# EAGLE design SenseRing (EAGLE 9.7.0)
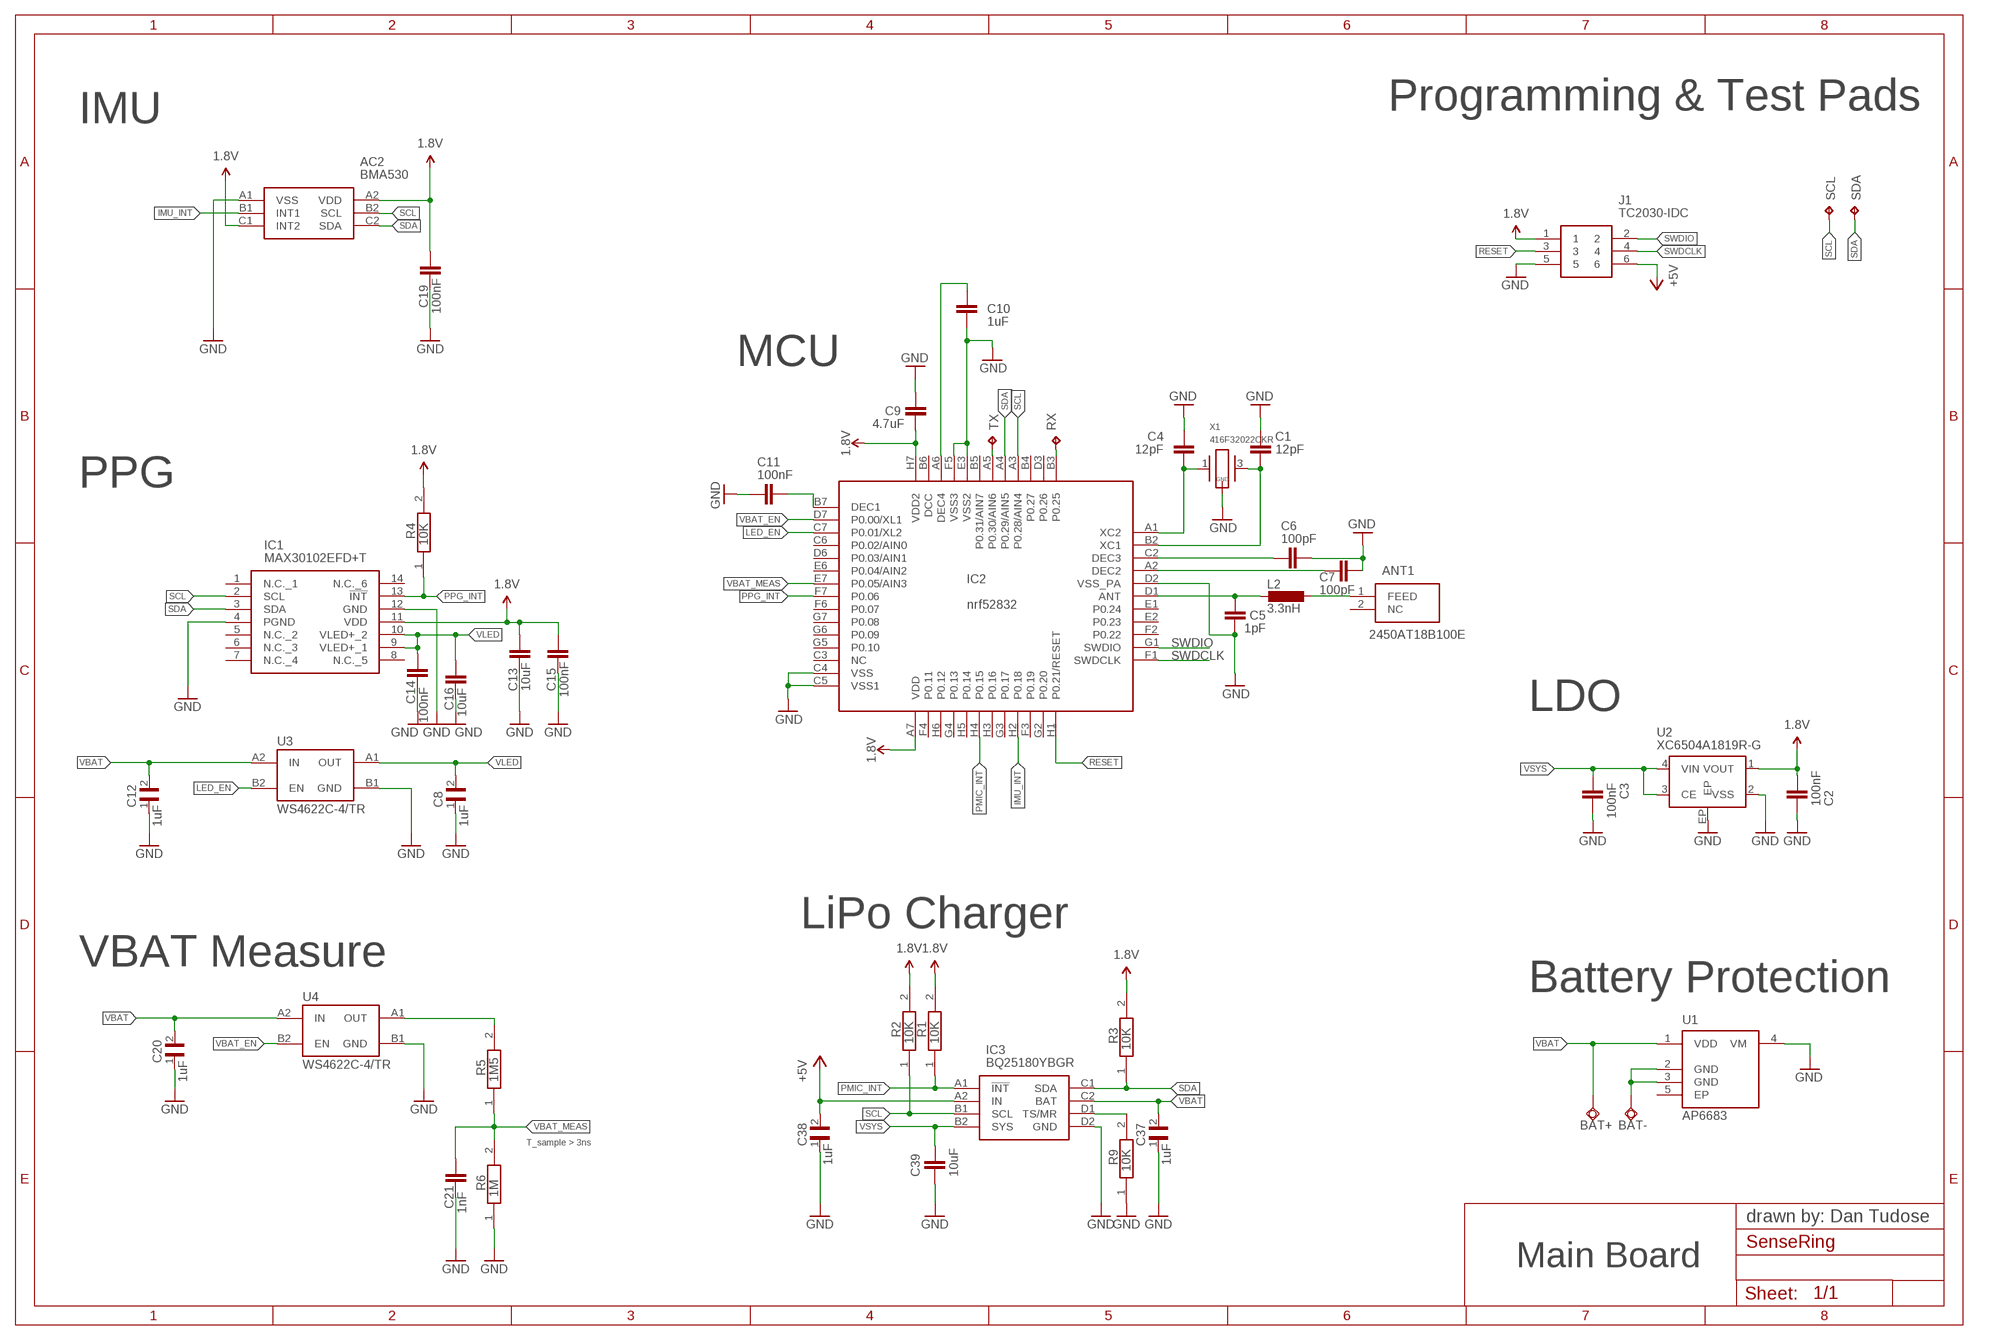
[diagram p0: schematic, sheet 1]

## Parts
AC2  BMA530  [BMA530]
ANT1  2450AT18B100E  [ANTC3216X140N]
BAT+  TPSQTP10SQ  [TP10SQ]
BAT-  TPSQTP10SQ  [TP10SQ]
C1  12pF  C-EUC0201  [C0201]
C2  100nF  C-EUC0201  [C0201]
C3  100nF  C-EUC0201  [C0201]
C4  12pF  C-EUC0201  [C0201]
C5  1pF  C-EUC0201  [C0201]
C6  100pF  C-EUC0201  [C0201]
C7  100pF  C-EUC0201  [C0201]
C8  1uF  GRM011R60J152KE01L  [0201]
C9  4.7uF  C-EUC0201  [C0201]
C10  1uF  C-EUC0201  [C0201]
C11  100nF  C-EUC0201  [C0201]
C12  1uF  GRM011R60J152KE01L  [0201]
C13  10uF  CAP_0402  [0402]
C14  100nF  C-EUC0201  [C0201]
C15  100nF  C-EUC0201  [C0201]
C16  10uF  CAP_0402  [0402]
C19  100nF  C-EUC0201  [C0201]
C20  1uF  GRM011R60J152KE01L  [0201]
C21  1nF  C-EUC0201  [C0201]
C37  1uF  GRM011R60J152KE01L  [0201]
C38  1uF  GRM011R60J152KE01L  [0201]
C39  10uF  CAP_0402  [0402]
IC1  MAX30102EFD+T  [MAX30102EFDT]
IC2  nrf52832  NRF52832  [NRF52832_WLCSP]
IC3  BQ25180YBGR  [BGA8C40P2X4_100X155X50]
J1  TC2030-IDC  [TC2030IDC]
L2  3.3nH  L-EUL0201  [L0201]
R1  10K  CPF0201D7K68C1  [0201]
R2  10K  CPF0201D7K68C1  [0201]
R3  10K  CPF0201D7K68C1  [0201]
R4  10K  CPF0201D7K68C1  [0201]
R5  1M5  CPF0201D7K68C1  [0201]
R6  1M  CPF0201D7K68C1  [0201]
R9  10K  CPF0201D7K68C1  [0201]
RX  TPTP06R  [TP06R]
SCL  TPTP06R  [TP06R]
SDA  TPTP06R  [TP06R]
TX  TPTP06R  [TP06R]
U1  AP6683  [DFN-4_L1.0-W1.0-P0.65-BL-EP]
U2  XC6504A1819R-G  [USPQ-4B04]
U3  WS4622C-4/TR  [CSP-4L_1X1]
U4  WS4622C-4/TR  [CSP-4L_1X1]
X1  416F32022CKR  M416F26022CKR  [M416]

## Nets
1.8V: AC2.A2(VDD) AC2.C1(INT2) C2.1 C9.2 C13.1 C15.2 C19.2 IC1.11(VDD) IC2.A7(VDD) IC2.H7(VDD2) J1.1 R1.2 R2.2 R3.2 R4.2 U2.1(VOUT)
+5V: C38.2 IC3.A2(IN) J1.6
GND: AC2.A1(VSS) C1.1 C2.2 C3.1 C4.1 C5.2 C6.2 C7.2 C8.1 C9.1 C10.2 C11.2 C12.1 C13.2 C14.1 C15.1 C16.2 C19.1 C20.1 C21.1 C37.1 C38.1 C39.2 IC1.4(PGND) IC1.12(GND) IC2.C4(VSS) IC2.C5(VSS1) IC2.D2(VSS_PA) IC2.E3(VSS2) IC2.F5(VSS3) IC3.D2(GND) J1.5 R6.1 R9.1 U1.4(VM) U2.2(VSS) U2.EP U3.B1(GND) U4.B1(GND) X1.2(GND) X1.4(GND)
IMU_INT: AC2.B1(INT1) IC2.H2(P0.18)
LED_EN: IC2.C7(P0.01/XL2) U3.B2(EN)
N$1: BAT-.TP U1.2(GND) U1.3(GND)
N$2: IC2.A5(P0.30/AIN6) TX.TP
N$3: IC2.B3(P0.25) RX.TP
N$4: C4.2 IC2.A1(XC2) X1.1
N$5: C7.1 IC2.A2(DEC2)
N$6: C1.2 IC2.B2(XC1) X1.3
N$7: C5.1 IC2.D1(ANT) L2.2
N$9: C6.1 IC2.C2(DEC3)
N$12: IC3.D1(TS/MR) R9.2
N$13: ANT1.1(FEED) L2.1
N$19: C11.1 IC2.B7(DEC1)
N$20: C10.1 IC2.A6(DEC4)
PMIC_INT: IC2.H4(P0.15) IC3.A1(!INT) R1.1
PPG_INT: IC1.13(!INT) IC2.F7(P0.06) R4.1
RESET: IC2.H1(P0.21/RESET) J1.3
SCL: AC2.B2(SCL) IC1.2(SCL) IC2.A3(P0.28/AIN4) IC3.B1(SCL) R2.1 SCL.TP
SDA: AC2.C2(SDA) IC1.3(SDA) IC2.A4(P0.29/AIN5) IC3.C1(SDA) R3.1 SDA.TP
SWDCLK: IC2.F1(SWDCLK) J1.4
SWDIO: IC2.G1(SWDIO) J1.2
VBAT: BAT+.TP C12.2 C20.2 C37.2 IC3.C2(BAT) U1.1(VDD) U3.A2(IN) U4.A2(IN)
VBAT_EN: IC2.D7(P0.00/XL1) U4.B2(EN)
VBAT_MEAS: C21.2 IC2.E7(P0.05/AIN3) R5.1 R6.2
VBAT_OUT: R5.2 U4.A1(OUT)
VLED: C8.2 C14.2 C16.1 IC1.9(VLED+_1) IC1.10(VLED+_2) U3.A1(OUT)
VSYS: C3.2 C39.1 IC3.B2(SYS) U2.3(CE) U2.4(VIN)
Unconnected: ANT1.2(NC) IC1.1(N.C._1) IC1.5(N.C._2) IC1.6(N.C._3) IC1.7(N.C._4) IC1.8(N.C._5) IC1.14(N.C._6) IC2.B4(P0.27) IC2.B5(P0.31/AIN7) IC2.B6(DCC) IC2.C3(NC) IC2.C6(P0.02/AIN0) IC2.D3(P0.26) IC2.D6(P0.03/AIN1) IC2.E1(P0.24) IC2.E2(P0.23) IC2.E6(P0.04/AIN2) IC2.F2(P0.22) IC2.F3(P0.19) IC2.F4(P0.11) IC2.F6(P0.07) IC2.G2(P0.20) IC2.G3(P0.17) IC2.G4(P0.13) IC2.G5(P0.10) IC2.G6(P0.09) IC2.G7(P0.08) IC2.H3(P0.16) IC2.H5(P0.14) IC2.H6(P0.12) U1.5(EP)

## Notes on the sheet
- IMU | Programming & Test Pads
- MCU
- PPG
- LDO
- LiPo Charger
- VBAT Measure
- Battery Protection
- T_sample > 3ns
- drawn by: Dan Tudose
- Main Board

## Library data of the parts
AC2 = BMA530:BMA530: Accelerometer with advanced feature set Source: Datasheet <https://www.bosch-sensortec.com/media/boschsensortec/downloads/datasheets/bst-bma530-ds000.pdf>; ARROW_PART_NUMBER: BMA530; ARROW_PRICE-STOCK: https://www.arrow.com/en/products/bma530/bosch-sensortec.html?utm_currency=USD&region=nac; DESCRIPTION: Accelerometer with advanced feature set; HEIGHT: 0.59mm; MANUFACTURER_NAME: BOSCH; MANUFACTURER_PART_NUMBER: BMA530; MOUSER_PART_NUMBER: 262-BMA530; MOUSER_PRICE-STOCK: https://www.mouser.co.uk/ProductDetail/Bosch-Sensortec/BMA530?qs=2wMNvWM5ZX4xN1KGqjzO%252Bg%3D%3D
ANT1 = 2450AT18B100E:2450AT18B100E: Antennas 2.45GHz ANTENNA Source: Datasheet <https://www.johansontechnology.com/datasheets/2450AT18B100/2450AT18B100.pdf>; ARROW_PART_NUMBER: 2450AT18B100E; ARROW_PRICE-STOCK: https://www.arrow.com/en/products/2450at18b100e/johanson-dielectrics?utm_currency=USD&region=europe; DESCRIPTION: Antennas 2.45GHz ANTENNA; HEIGHT: 1.4mm; MANUFACTURER_NAME: JOHANSON TECHNOLOGY; MANUFACTURER_PART_NUMBER: 2450AT18B100E; MOUSER_PART_NUMBER: 609-2450AT18B100E; MOUSER_PRICE-STOCK: https://www.mouser.co.uk/ProductDetail/Johanson-Technology/2450AT18B100E?qs=yCnrNFeXz%252Bh5MFsFIXGZGA%3D%3D
BAT+ BAT- = testpad:TPSQ: Test pad
C1-C7 C9-C11 C14 C15 C19 C21 = rcl:C-EU: CAPACITOR, European symbol; SPICEPREFIX: C
C8 C12 C20 C37 C38 = GRM011R60J152KE01L:GRM011R60J152KE01L: Check availability <https://pricing.snapeda.com/parts/GRM011R60J152KE01L/Murata/view-part?ref=eda>; SPICEPREFIX: C
C13 C16 C39 = Perfect_0402:CAP_0402: 0402 (1005 Metric) Nick Garner - TeleSense
IC1 = MAX30102EFD+T:MAX30102EFD+T: Biometric Sensors Integrated Optical Sensor Source: Datasheet <https://www.analog.com/media/en/technical-documentation/data-sheets/MAX30102.pdf>; ARROW_PART_NUMBER: MAX30102EFD+T; ARROW_PRICE-STOCK: https://www.arrow.com/en/products/max30102efdt/analog-devices?region=nac; DESCRIPTION: Biometric Sensors Integrated Optical Sensor; HEIGHT: 1.65mm; MANUFACTURER_NAME: Analog Devices; MANUFACTURER_PART_NUMBER: MAX30102EFD+T; MOUSER_PART_NUMBER: 700-MAX30102EFD+T; MOUSER_PRICE-STOCK: https://www.mouser.co.uk/ProductDetail/Analog-Devices-Maxim-Integrated/MAX30102EFD%2bT?qs=nVS1qgv%252BQrkHA4%2FoFYriFA%3D%3D
IC2 = dan:NRF52832
IC3 = BQ25180YBGR:BQ25180YBGR: Charger IC Lithium Ion/Polymer, Lithium Iron Phosphate 8-DSBGA (1.6x1.1) Source: Datasheet <https://www.ti.com/lit/ds/symlink/bq25180.pdf?ts=1650264094470&ref_url=https%3A%2F%2Fwww.ti.com%2Fproduct%2FBQ25180>; ARROW_PART_NUMBER: BQ25180YBGR; ARROW_PRICE-STOCK: https://www.arrow.com/en/products/bq25180ybgr/texas-instruments?utm_currency=USD&region=nac; DESCRIPTION: Charger IC Lithium Ion/Polymer, Lithium Iron Phosphate 8-DSBGA (1.6x1.1); HEIGHT: 0.5mm; MANUFACTURER_NAME: Texas Instruments; MANUFACTURER_PART_NUMBER: BQ25180YBGR; MOUSER_PART_NUMBER: 595-BQ25180YBGR; MOUSER_PRICE-STOCK: https://www.mouser.co.uk/ProductDetail/Texas-Instruments/BQ25180YBGR?qs=doiCPypUmgEWjAK%252BJAX6Tw%3D%3D
J1 = TC2030-IDC:TC2030-IDC: CABLE ADAPTER 6 POS Source: Datasheet <https://datasheet.datasheetarchive.com/originals/distributors/Datasheets_SAMA/62bc384e093448baaaa63dbd0b9d8707.pdf>; DESCRIPTION: CABLE ADAPTER 6 POS; HEIGHT: 19mm; MANUFACTURER_NAME: Tag Connect; MANUFACTURER_PART_NUMBER: TC2030-IDC
L2 = rcl:L-EU: INDUCTOR, European symbol; SPICEPREFIX: L
R1-R6 R9 = ERA-1AEB3401C:CPF0201D7K68C1: 7.68k 0201 Thin Film Surface Mount Fixed Resistor +/-0.5% 0.031W CPF0201D7K68C1 Source: Datasheet <http://www.te.com/commerce/DocumentDelivery/DDEController?Action=showdoc&DocId=Data Sheet1773200-1ApdfEnglishENG_DS_1773200-1_A.pdf4-2176215-6>; SPICEPREFIX: R
RX SCL SDA TX = testpad:TP: Test pad
U1 = AP6683:AP6683: Single-cell lithium ion and lithium polymer battery protection IC Manufacturer: ALLPOWER Supplier Part: C2849565; DATASHEET: https://item.szlcsc.com/datasheet/AP6683/3049182.html; MANUFACTURER: ALLPOWER; MPN: AP6683; SUPPLIER: LCSC; SUPPLIER_PART: C2849565
U2 = XC6504A1819R-G:XC6504A1819R-G: IC REG LIN 1.8V 150MA USPQ-4B04 Manufacturer: Torex Semiconductor Ltd Package: USPQ-4B04 (1.0 mm x 1.0 mm) JLCPCB Part: C5142782 Note: The thermal pad (EP) should be connected to VSS as per datasheet recommendations.; JLCPCB: C5142782; MANUFACTURER: Torex Semiconductor Ltd; MPN: XC6504A1819R-G
U3 U4 = WS4622C:WS4622C-4/TR: WS4622C-4/TR 1.2V~5.5V, 2A, 38mΩ Active High Load Switch Manufacturer: WILLSEMI (Will Semiconductor) Package: CSP-4L (1.0 mm x 1.0 mm) JLCPCB Part: C2939859; JLCPCB: C2939859; MANUFACTURER: WILLSEMI; MPN: WS4622C-4/TR
X1 = crystals:M416; DIGIKEY: CTX1407CT-ND

## Net classes
1 power: width 0.15 mm

## Board
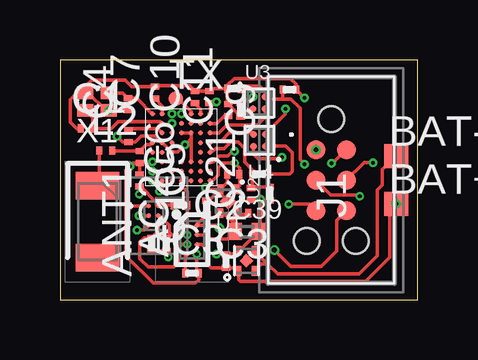
[diagram p1: board, top side]
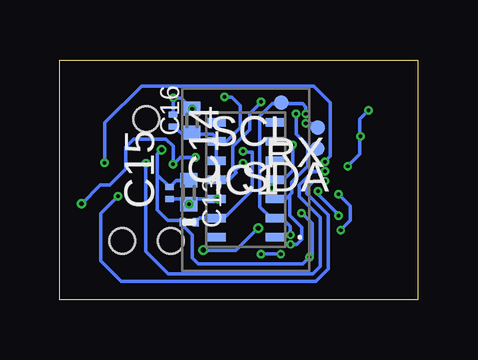
[diagram p2: board, bottom side, seen from below]

Size 14.9 x 10 mm. Coordinates in mm from the lower left corner, seen from the top.
Outline: 0,10 0,0 14.9,0 14.9,10 0,10
Copper layers (1*16): Top 0.035mm / dielectric 1.5mm / Bottom 0.035mm
Design rules "Fusion Electronics Design Rules *": minimum track width 6mil, minimum drill 0.2mm, track to track 6mil, track to pad 6mil, pad to pad 6mil, via to via 6mil, smd to smd 6mil, copper to edge 40mil, drill to drill 6mil, minimum pad ring 0.1mm, minimum via ring 0.1mm, stop-mask expansion 4mil, vias tented up to drill 9999mil, thermal gap 10mil

### Footprints (pad centres in the part's own frame; a part is rotated, then mirrored left to right if it is on the bottom)
BMA530 = smd 0.18 x 0.18: A1 -0.4,-0.2; A2 -0.4,0.2; B1 0,-0.2; B2 0,0.2; C1 0.4,-0.2; C2 0.4,0.2
ANTC3216X140N = smd 1.15 x 1.8: 1 -1.5,0; 2 1.5,0
TP10SQ = smd 1 x 1: TP 0,0
C0201 = smd 0.25 x 0.35: 1 -0.25,0; 2 0.25,0
0201 = smd 0.35 x 0.25: 1 0,0.275; 2 0,-0.275
0402 = smd 0.6 x 0.7: 1 -0.5,0; 2 0.5,0
MAX30102EFDT = smd 0.75 x 0.35: 1 -1.2,2.4; 2 -1.2,1.6; 3 -1.2,0.8; 4 -1.2,0; 5 -1.2,-0.8; 6 -1.2,-1.6; 7 -1.2,-2.4; 8 1.2,-2.4; 9 1.2,-1.6; 10 1.2,-0.8; 11 1.2,0; 12 1.2,0.8; 13 1.2,1.6; 14 1.2,2.4
NRF52832_WLCSP = smd 0.2 x 0.2: A1 -1.2,1.4; A2 -0.8,1.4; A3 -0.4,1.4; A4 0,1.4; A5 0.4,1.4; A6 0.8,1.4; A7 1.2,1.4; B2 -0.8,1; B3 -0.4,1; B4 0,1; B5 0.4,1; B6 0.8,1; B7 1.2,1; C2 -0.8,0.6; C3 -0.4,0.6; C4 0,0.6; C5 0.4,0.6; C6 0.8,0.6; C7 1.2,0.6; D1 -1.2,0.2; D2 -0.8,0.2; D3 -0.4,0.2; D6 0.8,0.2; D7 1.2,0.2; E1 -1.2,-0.2; E2 -0.8,-0.2; E3 -0.4,-0.2; E6 0.8,-0.2; E7 1.2,-0.2; F1 -1.2,-0.6; F2 -0.8,-0.6; F3 -0.4,-0.6; F4 0,-0.6; F5 0.4,-0.6; F6 0.8,-0.6; F7 1.2,-0.6; G1 -1.2,-1; G2 -0.8,-1; G3 -0.4,-1; G4 0,-1; G5 0.4,-1; G6 0.8,-1; G7 1.2,-1; H1 -1.2,-1.4; H2 -0.8,-1.4; H3 -0.4,-1.4; H4 0,-1.4; H5 0.4,-1.4; H6 0.8,-1.4; H7 1.2,-1.4
BGA8C40P2X4_100X155X50 = smd 0.2 x 0.2: A1 -0.2,0.6; A2 0.2,0.6; B1 -0.2,0.2; B2 0.2,0.2; C1 -0.2,-0.2; C2 0.2,-0.2; D1 -0.2,-0.6; D2 0.2,-0.6
TC2030IDC = smd 0.783 x 0.783: 1 -0.953,-0.635; 2 -0.953,0.635; 3 0.317,-0.635; 4 0.317,0.635; 5 1.588,-0.635; 6 1.588,0.635 | hole 1.067: -2.223,0; 2.857,-1.016; 2.857,1.016
L0201 = smd 0.25 x 0.35: 1 -0.275,0; 2 0.275,0
TP06R = smd 0.6 x 0.6: TP 0,0
DFN-4_L1.0-W1.0-P0.65-BL-EP = smd 0.2 x 0.4: 1 -0.325,-0.425; 2 0.325,-0.425; 3 0.325,0.425; 4 -0.325,0.425 | smd 0.4 x 0.4 rotated 225: 5 0,0
USPQ-4B04 = smd 0.4 x 0.25: 1 -0.501,0.325; 2 -0.501,-0.325; 3 0.501,-0.325; 4 0.475,0.325 | smd 0.48 x 0.48 rotated 135: EP 0,0
CSP-4L_1X1 = smd 0.3 x 0.3: A1 -0.25,0.25; A2 0.25,0.25; B1 -0.25,-0.25; B2 0.25,-0.25
M416 = smd 0.67 x 0.52: 1 -0.485,-0.36; 2 0.485,-0.36; 3 0.485,0.36; 4 -0.485,0.36

### Placement (x,y rotation side)
AC2  3.9,3.5 270 top
ANT1  1.57,3.25 270 top
BAT+  14,4 0 top
BAT-  14,6 0 top
C1  1.11,7.14 0 top
C2  7.21,5.23 180 top
C3  8.1,3.61 180 top
C4  2.84,8.15 90 top
C5  3.32,5.94 270 top
C6  2.86,6.83 270 top
C7  3.96,8.63 90 top
C8  7.52,7.92 180 top
C9  6.23,8.44 270 top
C10  5.63,8.44 90 top
C11  7.01,7.91 90 top
C12  7.25,8.8 90 top
C13  9.53,4.47 270 bottom
C14  10.18,7.47 270 bottom
C15  10.33,4.44 90 bottom
C16  9.4,7.47 90 bottom
C19  3.32,4.96 270 top
C20  9.56,8.76 270 top
C21  7.95,4.41 90 top
C37  6.92,1.61 0 top
C38  6.11,3.83 0 top
C39  7.78,2.84 0 top
IC1  7.16,5 180 bottom
IC2  5.06,6.35 0 top
IC3  5.5,2.5 0 top
J1  11.3,5.3 270 top
L2  1.91,6.22 0 top
R1  5.02,3.94 270 top
R2  4.43,2.3 0 top
R3  3.81,2.3 0 top
R4  9.52,3.23 270 bottom
R5  8.29,5.24 90 top
R6  8.74,4.42 180 top
R9  5.5,1.1 270 top
RX  4.17,7.18 180 bottom
SCL  5.68,8.22 180 bottom
SDA  4.19,6.31 180 bottom
TX  4.83,8.38 0 top
U1  7.77,1.62 0 top
U2  7,4.1 270 top
U3  8.3,8.2 0 top
U4  8.31,6.65 180 top
X1  1.54,8.26 180 top

### Tracks (layer width: path | path; a pad name or v marks a point on that pad's centre or on a via)
1.8V  (via drill 0.15 pad 0.2, 0.2 pad 0.2)
  Top 0.152: IC2.A7 6.26,8.16 C9.2 6.29,8.25 v6.52,8.25 | R3.2 R2.2 4.51,1.95 v4.51,1.77 | 4.72,4 R1.2 | 7.32,4.62 U2.1 7.49,4.77 7.49,5.2 C2.1 7.48,5.25 7.48,5.5 v7.28,5.7 6.77,5.7 6.59,5.52 6.59,5.19 6.35,4.95 IC2.H7 | R1.2 4.14,3.94 AC2.A2 4.01,3.99 4.01,4.06 3.36,4.71 C19.2 3.32,4.42 v3.3,4.4 | R1.2 4.75,3.82 4.81,3.75 4.81,3.63 v4.83,3.61 | AC2.C1 3.5,2.9 v3.2,2.9
  Bottom 0.152: C13.1 9.56,4.97 | 8.38,5.07 IC1.11 | IC1.11 9.5,5 C13.1 | C13.1 10.05,4.97 C15.2 10.85,5.21 | v10.66,6.25 10.85,6.07 10.85,5.21 | v7.28,5.7 7.62,5.36 | IC1.11 7.86,5 7.56,5.3 7.62,5.36 | v6.52,8.25 7,7.77 7,7.1 7.71,6.39 7.71,5.45 7.62,5.36 | v4.83,3.61 4.39,3.17 4.39,1.89 v4.51,1.77 4.79,1.49 9.14,1.49 9.38,1.73 9.38,2.69 9.85,3.16 9.76,3.16 9.83,3.23 | 10.85,5.21 10.85,3.75 10.4,3.3 9.9,3.3 9.83,3.23 | R4.2 9.83,3.23 | v3.3,4.4 2.8,3.9 2.8,3.3 v3.2,2.9
+5V  (via drill 0.2 pad 0.2)
  Top 0.152: C38.2 5.7,3.14 IC3.A2 6.5,3.1 6.62,2.98 v6.64,2.98 | J1.6 11.53,3.3 11.53,2.03 10.88,1.39 9.61,1.39 v8.93,2.07
  Bottom 0.152: v6.64,2.98 7.57,2.05 8.75,2.05 8.77,2.07 v8.93,2.07
GND  (via drill 0.15 pad 0.2)
  Top 0.152: 7.03,1.86 C37.1 | C38.1 6.25,4.16 6.55,4.46 U2.2 | 6.71,4.62 U2.2 | 8,4.12 C21.1 8.33,4.16 v8.35,4.18 | 8.33,3.71 C3.1 | 8.36,2.98 C39.2 | 8.33,3.56 C3.1 | 3.4,5.66 C5.2 | C4.1 2.6,7.9 2.57,7.92 2.05,7.92 X1.4 v2.04,7.9 1.9,7.9 1.18,8.62 X1.2 | U3.B1 7.92,7.97 7.62,7.66 7.59,7.66 C8.1 C11.2 6.97,8.2 C12.1 | C12.1 6.34,8.8 C9.1 C10.2 5.4,8.92 4,8.92 C7.2 2.98,8.88 2.71,9.15 1.33,9.15 1.06,8.88 X1.2 | IC3.D2 5.7,1.18 R9.1 5.78,0.83 5.63,0.69 3.88,0.69 2.74,1.83 2.74,3.6 | J1.5 10.4,3.98 v9.53,3.98 | C1.1 0.7,7.14 0.43,7.41 0.43,8.35 0.7,8.62 X1.2 | 2.74,3.6 2.74,5.4 v2.91,5.57 3.03,5.69 C5.2 | U4.B1 9.39,7.73 v9.39,7.95 | U2.2 6.96,4.89 C2.2 | C3.1 v8.35,4.18 | R6.1 8.38,4.14 v8.35,4.18 | C3.1 8.35,2.91 C39.2 | C39.2 8.19,2.75 8.17,2.75 | IC2.F5 IC2.C5 | IC2.C4 IC2.C5 | IC2.C5 5.46,6.71 v5.21,6.46 4.9,6.15 IC2.E3 IC2.D2 3.98,6.83 3.38,6.83 3.13,6.58 C6.2 2.62,6.58 v2.38,6.82 | C5.2 C19.1 | AC2.A1 3.04,3.9 2.74,3.6 | v10.18,8.41 C20.1 9.84,8.98 9.6,9.22 7.25,9.22 6.97,8.94 C12.1 | C39.2 7.49,2.05 U1.4 7.3,1.91 6.93,1.91 6.92,1.89 C37.1 | C37.1 6.54,1.88 v6.52,1.9 | U2.2 6.12,4.6 v6.06,4.66 | U2.2 6.67,4.42 U2.EP
  Bottom 0.152: IC1.4 5.94,5.07 | C13.2 9.6,3.97 | 9.3,7.97 C16.2 | C16.2 9.84,8.41 v10.18,8.41 C14.1 | C13.2 9.75,4.19 C15.1 | C13.2 9.3,4.2 IC1.12 v8.36,4.19 v8.35,4.18 | IC1.4 5.93,5.03 5.56,5.03 5.21,5.38 v5.21,6.46 | 2.4,6.86 2.4,7.54 v2.04,7.9 | 2.4,6.86 2.4,6.08 v2.91,5.57 | IC3.D2 v6.52,1.9 | IC1.4 6.06,4.9 v6.06,4.66 | v2.38,6.82 2.38,6.84 2.4,6.86 | v9.53,3.98 C13.2 | C16.2 v9.39,7.96 v9.39,7.95
  other vias: 5.7,1.9
IMU_INT  (via drill 0.15 pad 0.2)
  Top 0.152: AC2.B1 v3.29,3.5 | IC2.H2 4.26,4.65 v4.14,4.53
  Bottom 0.152: v4.14,4.53 4.14,4.39 3.29,3.54 v3.29,3.5
LED_EN
  Top 0.152: IC2.C7 6.61,6.95 6.94,7.28 8.21,7.28 8.55,7.62 U3.B2
N$1
  Top 0.152: BAT-.TP 13.42,5.42 13.42,4.79 13.21,4.58 13.21,1.82 12.46,1.07 9.07,1.07 8.64,1.5 | 8.64,1.5 U1.3 | U1.2 8.39,1.5 8.64,1.5
N$2
  Top 0.152: TX.TP 4.92,8.38 5.46,7.84 IC2.A5
N$3  (via drill 0.15 pad 0.2)
  Bottom 0.152: RX.TP 4.34,7.35 IC2.B3
  other vias: 4.66,7.35
N$4
  Top 0.152: X1.1 2.61,8.62 C4.2 3.2,8.4 IC2.A1
N$5
  Top 0.152: IC2.A2 4.26,8.08 C7.1
N$6
  Top 0.152: IC2.B2 4.18,7.43 2.43,7.43 2.14,7.14 C1.2 1.36,7.6 X1.3
N$7
  Top 0.152: IC2.D1 3.77,6.46 3.59,6.46 C5.1 2.21,6.2 L2.2
N$9
  Top 0.152: 4.23,6.95 IC2.C2 4.08,7.13 2.91,7.13 C6.1 2.88,7.07
N$12
  Top 0.152: R9.2 5.22,1.82 IC3.D1
N$13
  Top 0.152: L2.1 1.64,4.82 ANT1.1
N$19
  Top 0.152: C11.1 6.85,7.66 6.54,7.35 IC2.B7
N$20
  Top 0.152: IC2.A6 5.86,7.93 5.63,8.16 C10.1
PMIC_INT
  Top 0.152: IC3.A1 R1.1 5.29,4.51 5.06,4.75 IC2.H4
PPG_INT  (via drill 0.15 pad 0.2)
  Top 0.152: IC2.F7 6.38,5.75 6.63,6 6.99,6 7.17,6.18 v7.27,6.18
  Bottom 0.152: v7.27,6.18 7.25,6.16 6.88,6.16 6.88,4.57 8.09,3.36 8.32,3.36 IC1.13 9.07,3.4 R4.1
RESET  (via drill 0.15 pad 0.2)
  Top 0.152: v12.49,4.31 12.44,4.36 11.29,4.36 J1.3
  Bottom 0.152: v12.49,4.31 13.2,3.6 13.2,1.61 12.35,0.76 4.24,0.76 3.72,1.28 3.72,3.54 4.62,4.44 4.62,4.65 4.32,4.95 IC2.H1
  other vias: 3.86,4.95
SCL  (via drill 0.15 pad 0.2)
  Top 0.152: AC2.B2 4.16,3.5 4.56,3.1 4.56,2.8 | 4.56,2.8 4.66,2.7 IC3.B1 | 4.56,2.8 4.56,2.79 | 4.56,2.79 4.56,2.71 R2.1 | 4.62,2.73 4.56,2.79
  Bottom 0.152: IC2.A3 4.66,8.04 4.79,8.17 5.63,8.17 | 5.63,8.17 6.05,8.17 6.57,7.65 6.57,3.87 6.1,3.4 IC1.2 5.65,3.4 5.3,3.05 IC3.B1 | SCL.TP 5.63,8.17
  other vias: 4.66,7.75 5.3,2.7
SDA  (via drill 0.15 pad 0.2)
  Top 0.152: AC2.C2 4.1,2.87 R3.1 3.5,2.58 3.33,2.4 3.33,1.7 3.67,1.36 4.74,1.36 4.92,1.54 4.92,2.15 5.07,2.3 IC3.C1
  Bottom 0.152: IC1.3 5.49,4.2 5.33,4.36 | 4.58,6.33 4.58,5.57 5.24,4.91 5.24,4.45 5.33,4.36 | 4.58,6.33 4.58,6.42 5.06,6.9 IC2.A4 | IC3.C1 5.03,2.3 4.82,2.51 4.82,3.01 5.33,3.52 5.33,4.36 | SDA.TP 4.21,6.33 4.58,6.33
  other vias: 5.06,7.75 5.3,2.3
SWDCLK  (via drill 0.15 pad 0.2)
  Top 0.152: v13.04,5.71 12.67,5.71 J1.4
  Bottom 0.152: IC2.F1 3.63,5.98 3.63,8.22 4.32,8.91 11.5,8.91 13.03,7.38 13.03,5.73 v13.04,5.71
  other vias: 3.86,5.75
SWDIO  (via drill 0.15 pad 0.2)
  Top 0.152: J1.2 11.37,5.69 v11.32,5.69
  Bottom 0.152: IC2.G1 4.36,5.35 4.93,4.79 4.93,4.3 4.06,3.44 4.06,1.38 4.37,1.07 10.38,1.07 11.32,2.01 v11.32,5.69
  other vias: 3.86,5.35
VBAT  (via drill 0.15 pad 0.2, 0.2 pad 0.2)
  Top 0.152: C12.2 7.63,8.91 8.33,8.91 8.55,8.69 U3.A2 8.64,8.36 9.28,8.36 | U4.A2 8.06,6.07 8.24,5.89 9.22,5.89 v9.26,5.93 | 9.28,8.36 9.62,8.36 10,7.98 10,5.84 v10.2,5.64 v10.19,5.64 | IC3.C2 5.91,2.3 6.11,2.1 6.11,1.53 6.31,1.33 C37.2 7.19,1.32 7.31,1.2 U1.1 7.44,0.83 7.51,0.76 12.73,0.76 13.73,1.76 13.73,3.73 BAT+.TP | 9.24,8.71 C20.2 9.29,8.37 9.28,8.36 | 9.27,5.92 v9.26,5.93 | v9.26,5.93 v9.25,5.93
  Bottom 0.152: v9.25,5.93 9.89,5.93 v10.19,5.63 v10.19,5.64 10.19,6.4 10.49,6.7 11.82,6.7 12.16,6.36 12.16,5.44 12.82,4.78 13.22,4.78 BAT+.TP
  other vias: 14,4
VBAT_EN
  Top 0.152: U4.B2 8,6.96 7.06,6.96 6.72,6.62 6.33,6.62 IC2.D7
VBAT_MEAS
  Top 0.152: R6.2 7.99,4.7 C21.2 8.02,4.72 R5.1 8.02,5.42 7.7,5.73 7.7,6.3 7.43,6.57 7.11,6.57 6.85,6.31 6.49,6.31 6.33,6.15 IC2.E7
VBAT_OUT
  Top 0.152: U4.A1 9.41,6.4 9.68,6.13 9.68,5.35 9.57,5.24 R5.2
VLED  (via drill 0.15)
  Top 0.152: U3.A1 7.88,8.45 7.62,8.19 C8.2
  Bottom 0.152: C14.2 9.73,6.84 9.53,7.04 9.5,6.83 C16.1 9.3,6.9 8.53,6.9 8.38,6.75 IC1.9 8.38,6.6 | 8.38,6.6 8.38,5.83 IC1.10 | U3.A1 7.75,8.45 7.39,8.09 7.39,7.17 7.96,6.6 8.38,6.6
  other vias: 8.05,8.45
VSYS
  Top 0.152: 7.43,3.55 7.32,3.55 U2.4 | 7.43,3.55 7.88,3.55 C3.2 | 7.24,3.19 7.24,3.35 7.43,3.55 | 7.24,3.19 7.24,2.88 C39.1 6.98,2.54 6.12,2.54 5.96,2.7 IC3.B2 | 7.24,3.19 6.8,3.6 U2.3